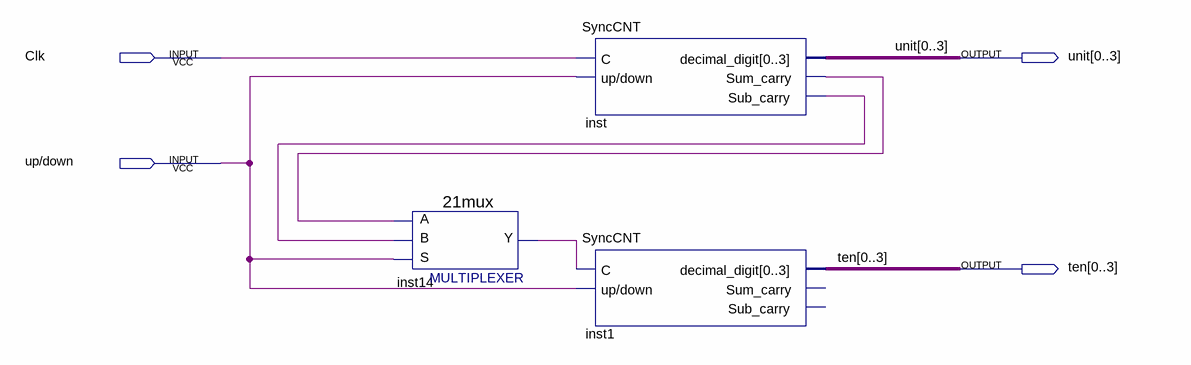
[diagram p0: schematic sheet]
// Quartus schematic SyncCNT_up_down.bdf as structural Verilog: 3 symbols, 4 pins
module SyncCNT_up_down (
  input  Clk,
  input  \up/down ,
  output [0:3] unit,
  output [0:3] ten
);

  wire inst14_y, inst_sub_carry, inst_sum_carry;

  \21mux  inst14 (.S(\up/down ), .B(inst_sub_carry), .A(inst_sum_carry), .Y(inst14_y));
  SyncCNT inst (
    .C(Clk), .\up/down (\up/down ), .decimal_digit(unit), .Sum_carry(inst_sum_carry),
    .Sub_carry(inst_sub_carry));
  SyncCNT inst1 (.C(inst14_y), .\up/down (\up/down ), .decimal_digit(ten));  // open: Sum_carry, Sub_carry
endmodule
